# Altium schematic sheet ADC-Schematic.SchDoc: ADC
size A1; Date: *3; DrawnBy: Ali Jafari; Time: ومم
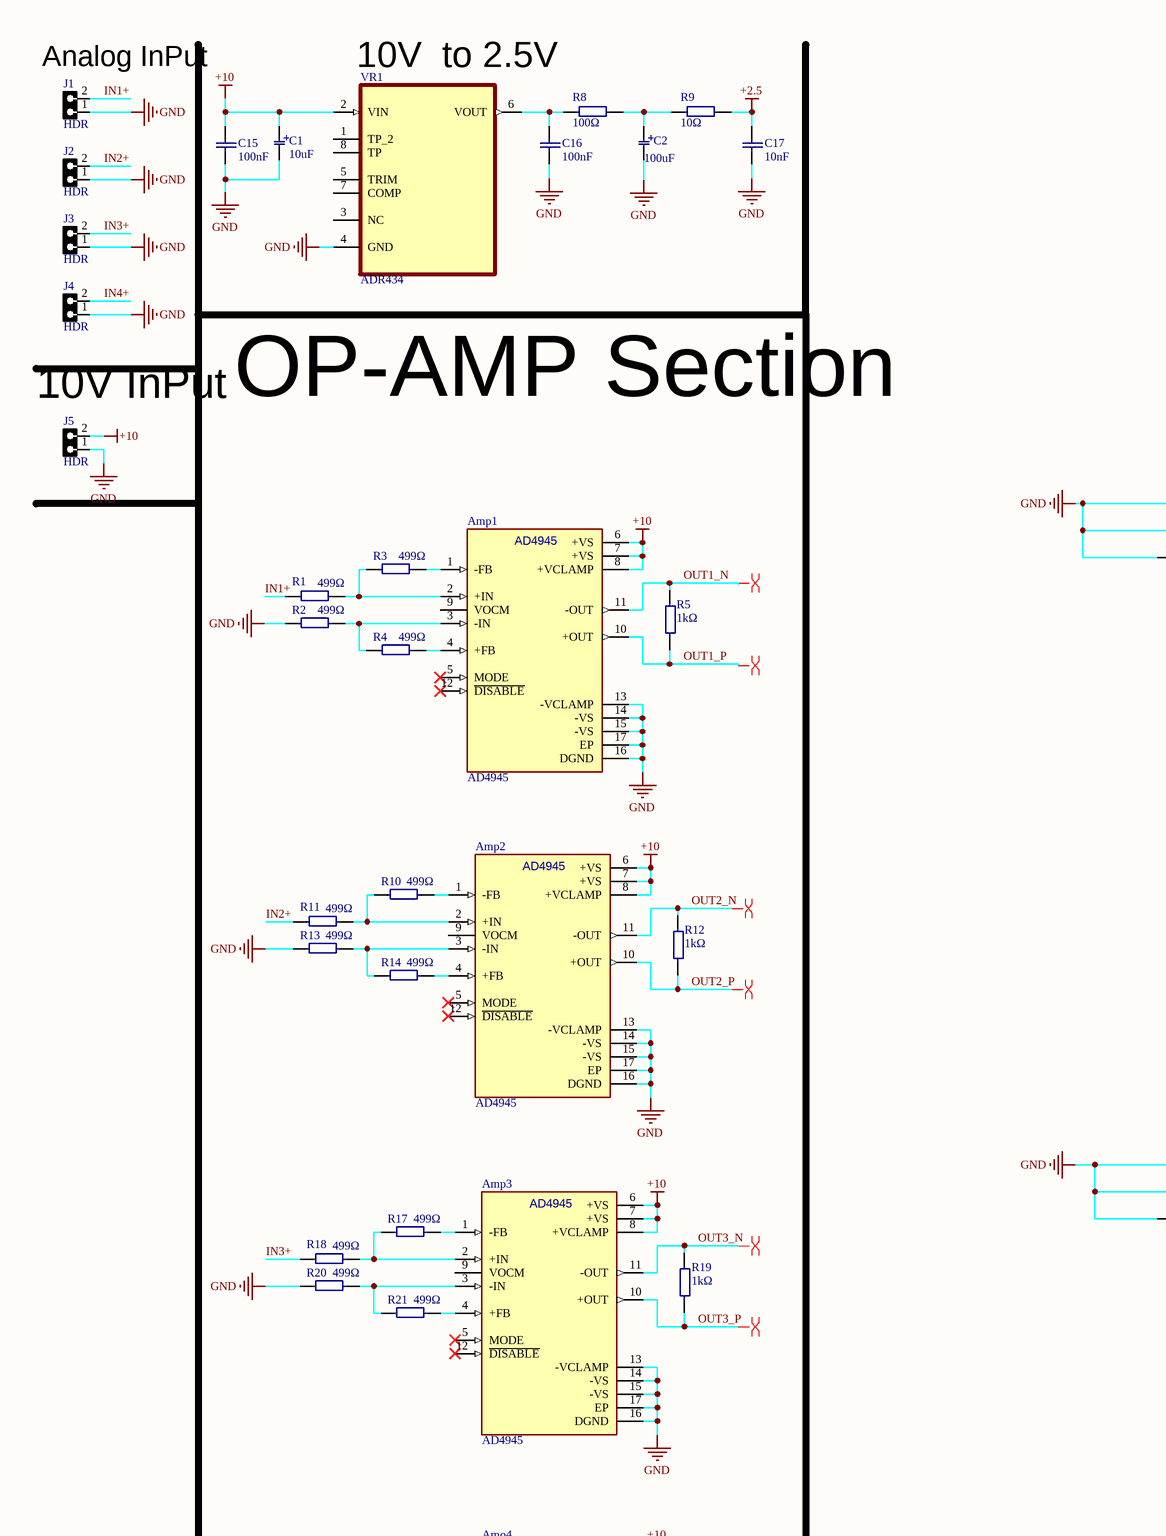
[diagram p0: ADC-Schematic.SchDoc, top left]
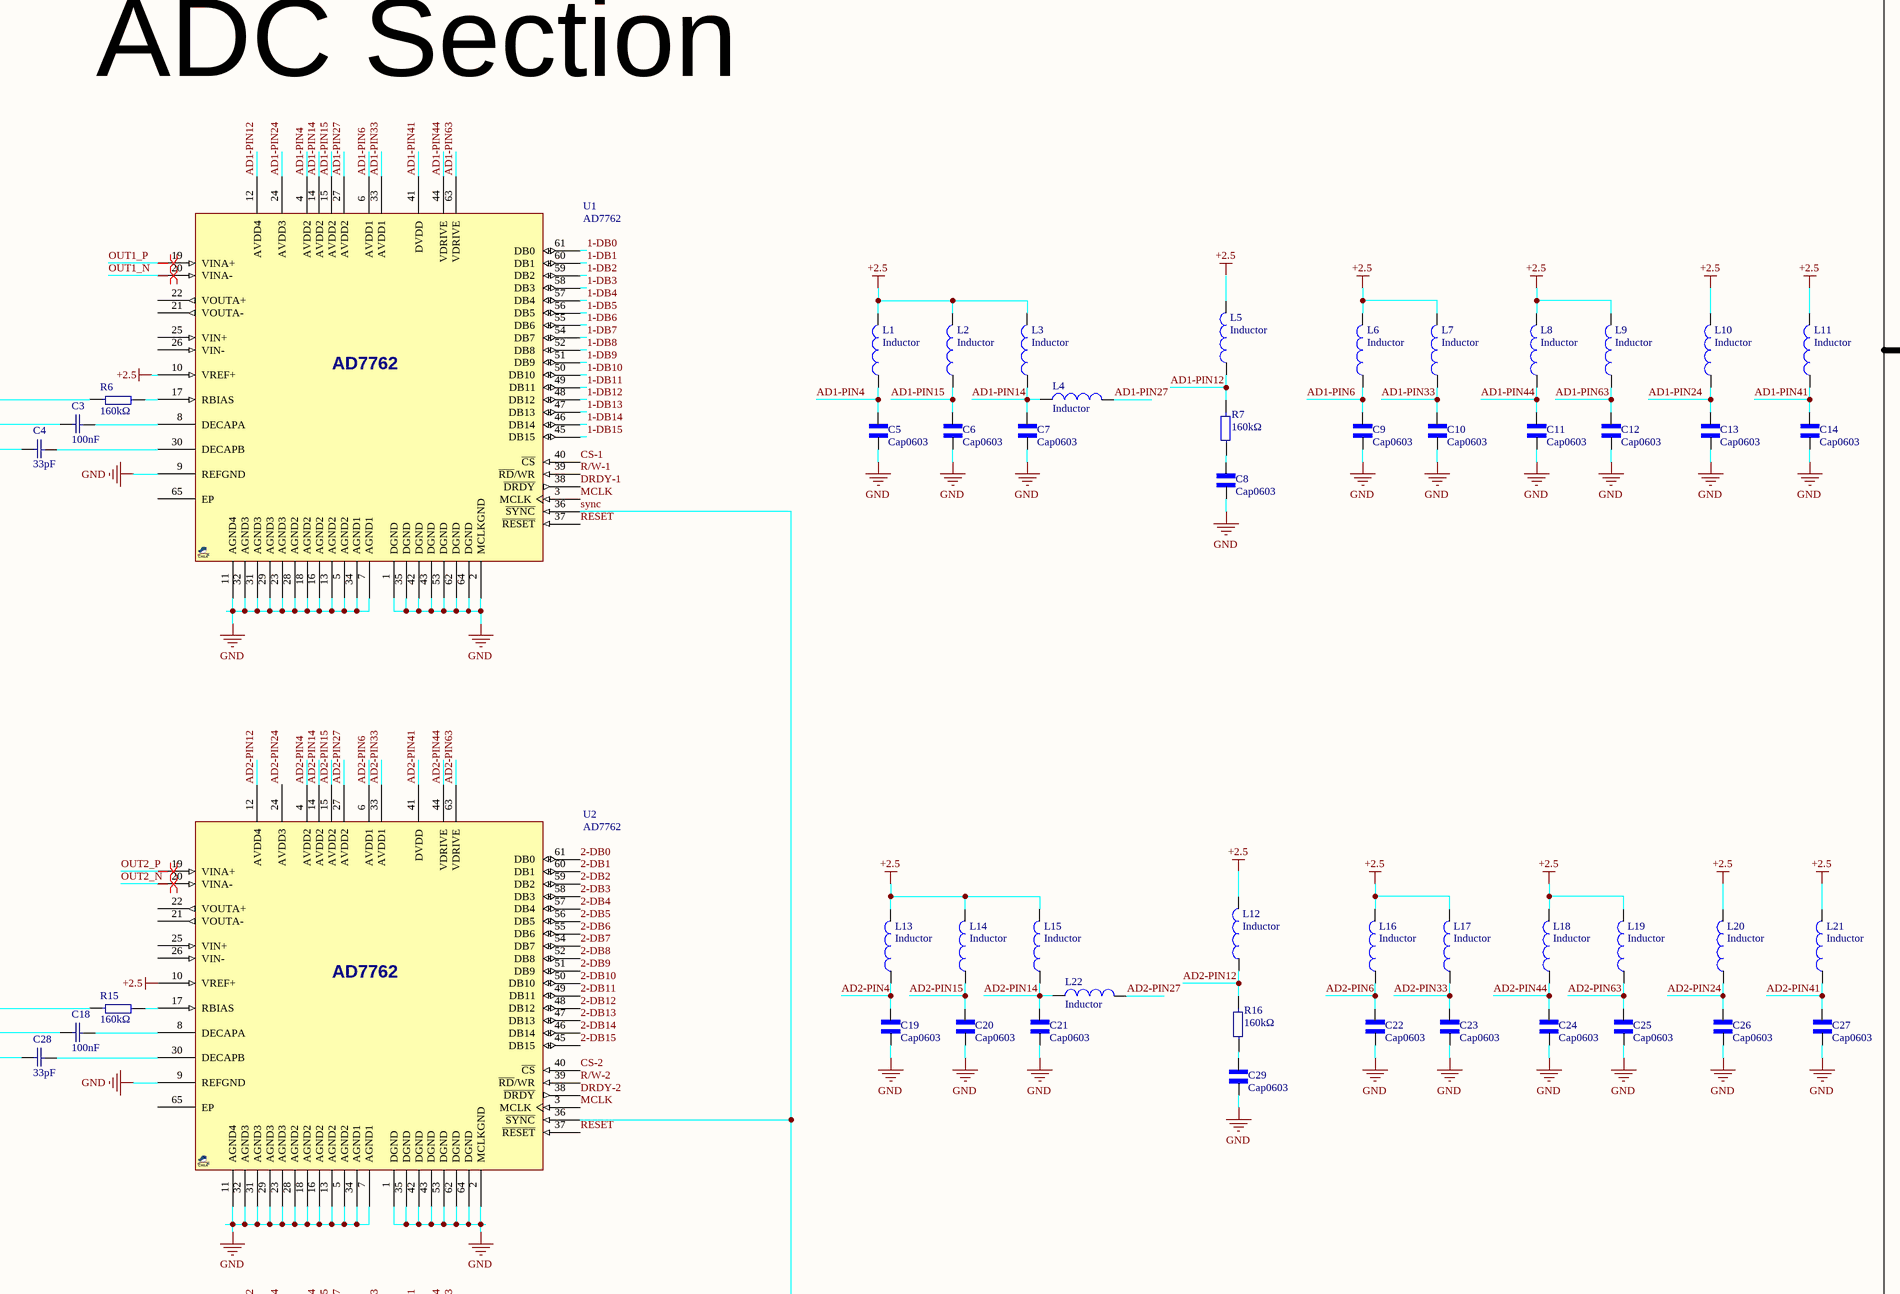
[diagram p1: ADC-Schematic.SchDoc, top middle]
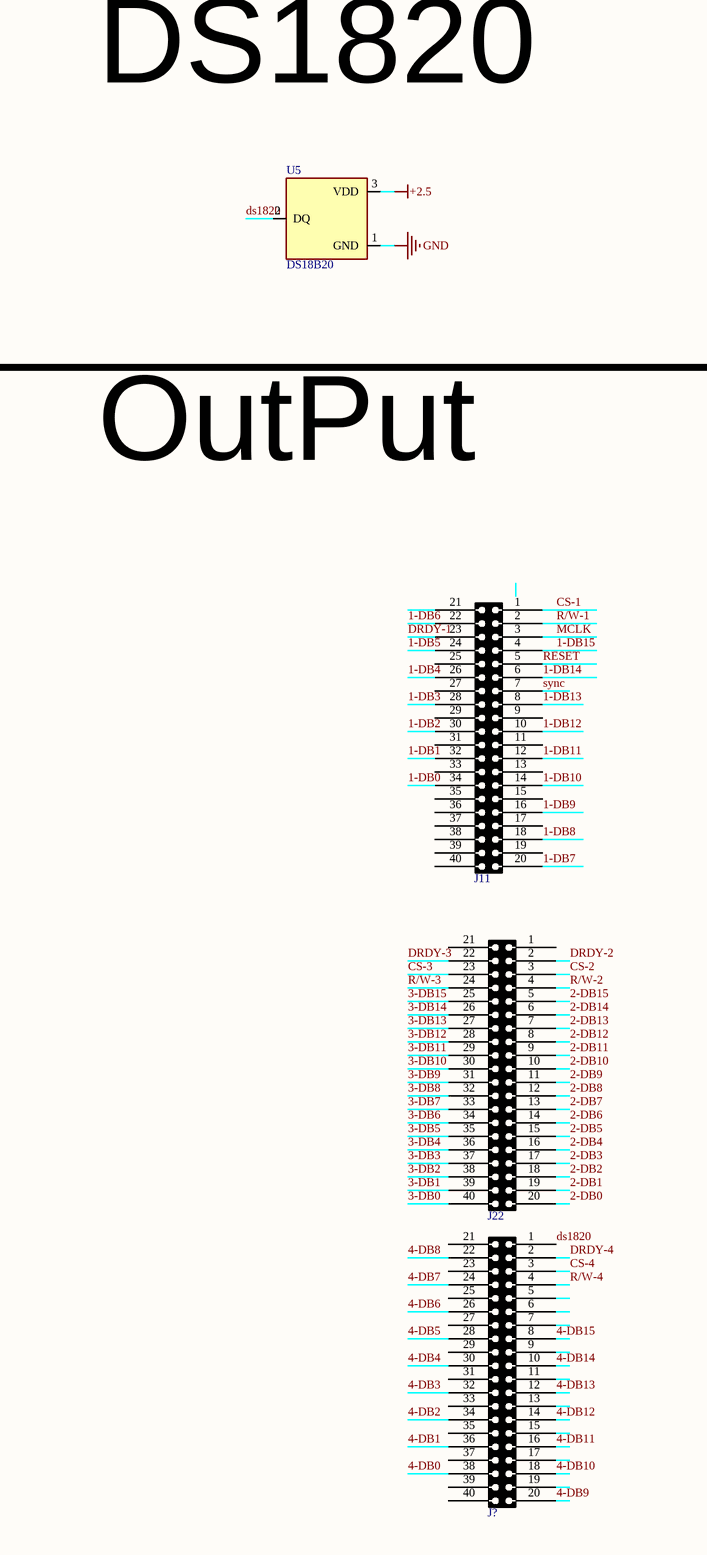
[diagram p2: ADC-Schematic.SchDoc, top right]
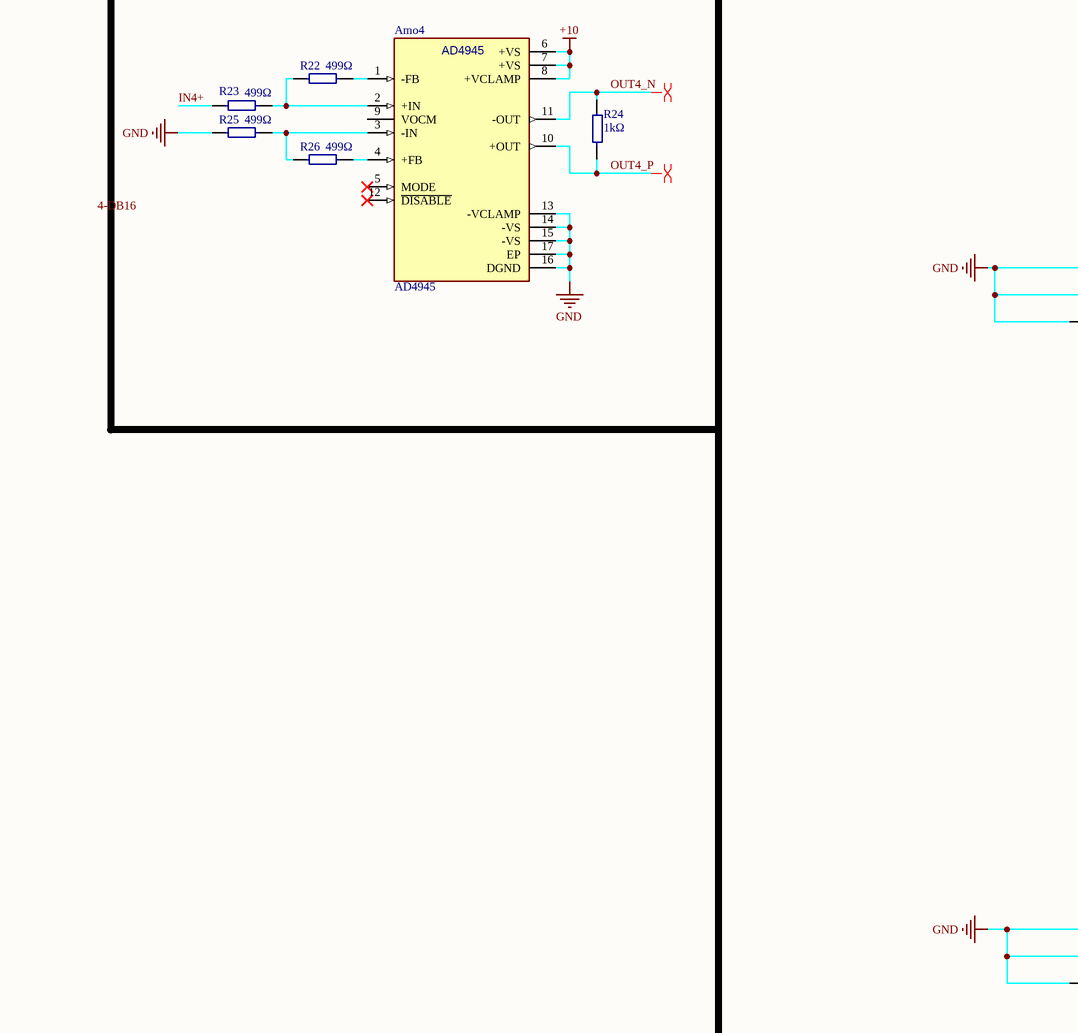
[diagram p3: ADC-Schematic.SchDoc, bottom left]
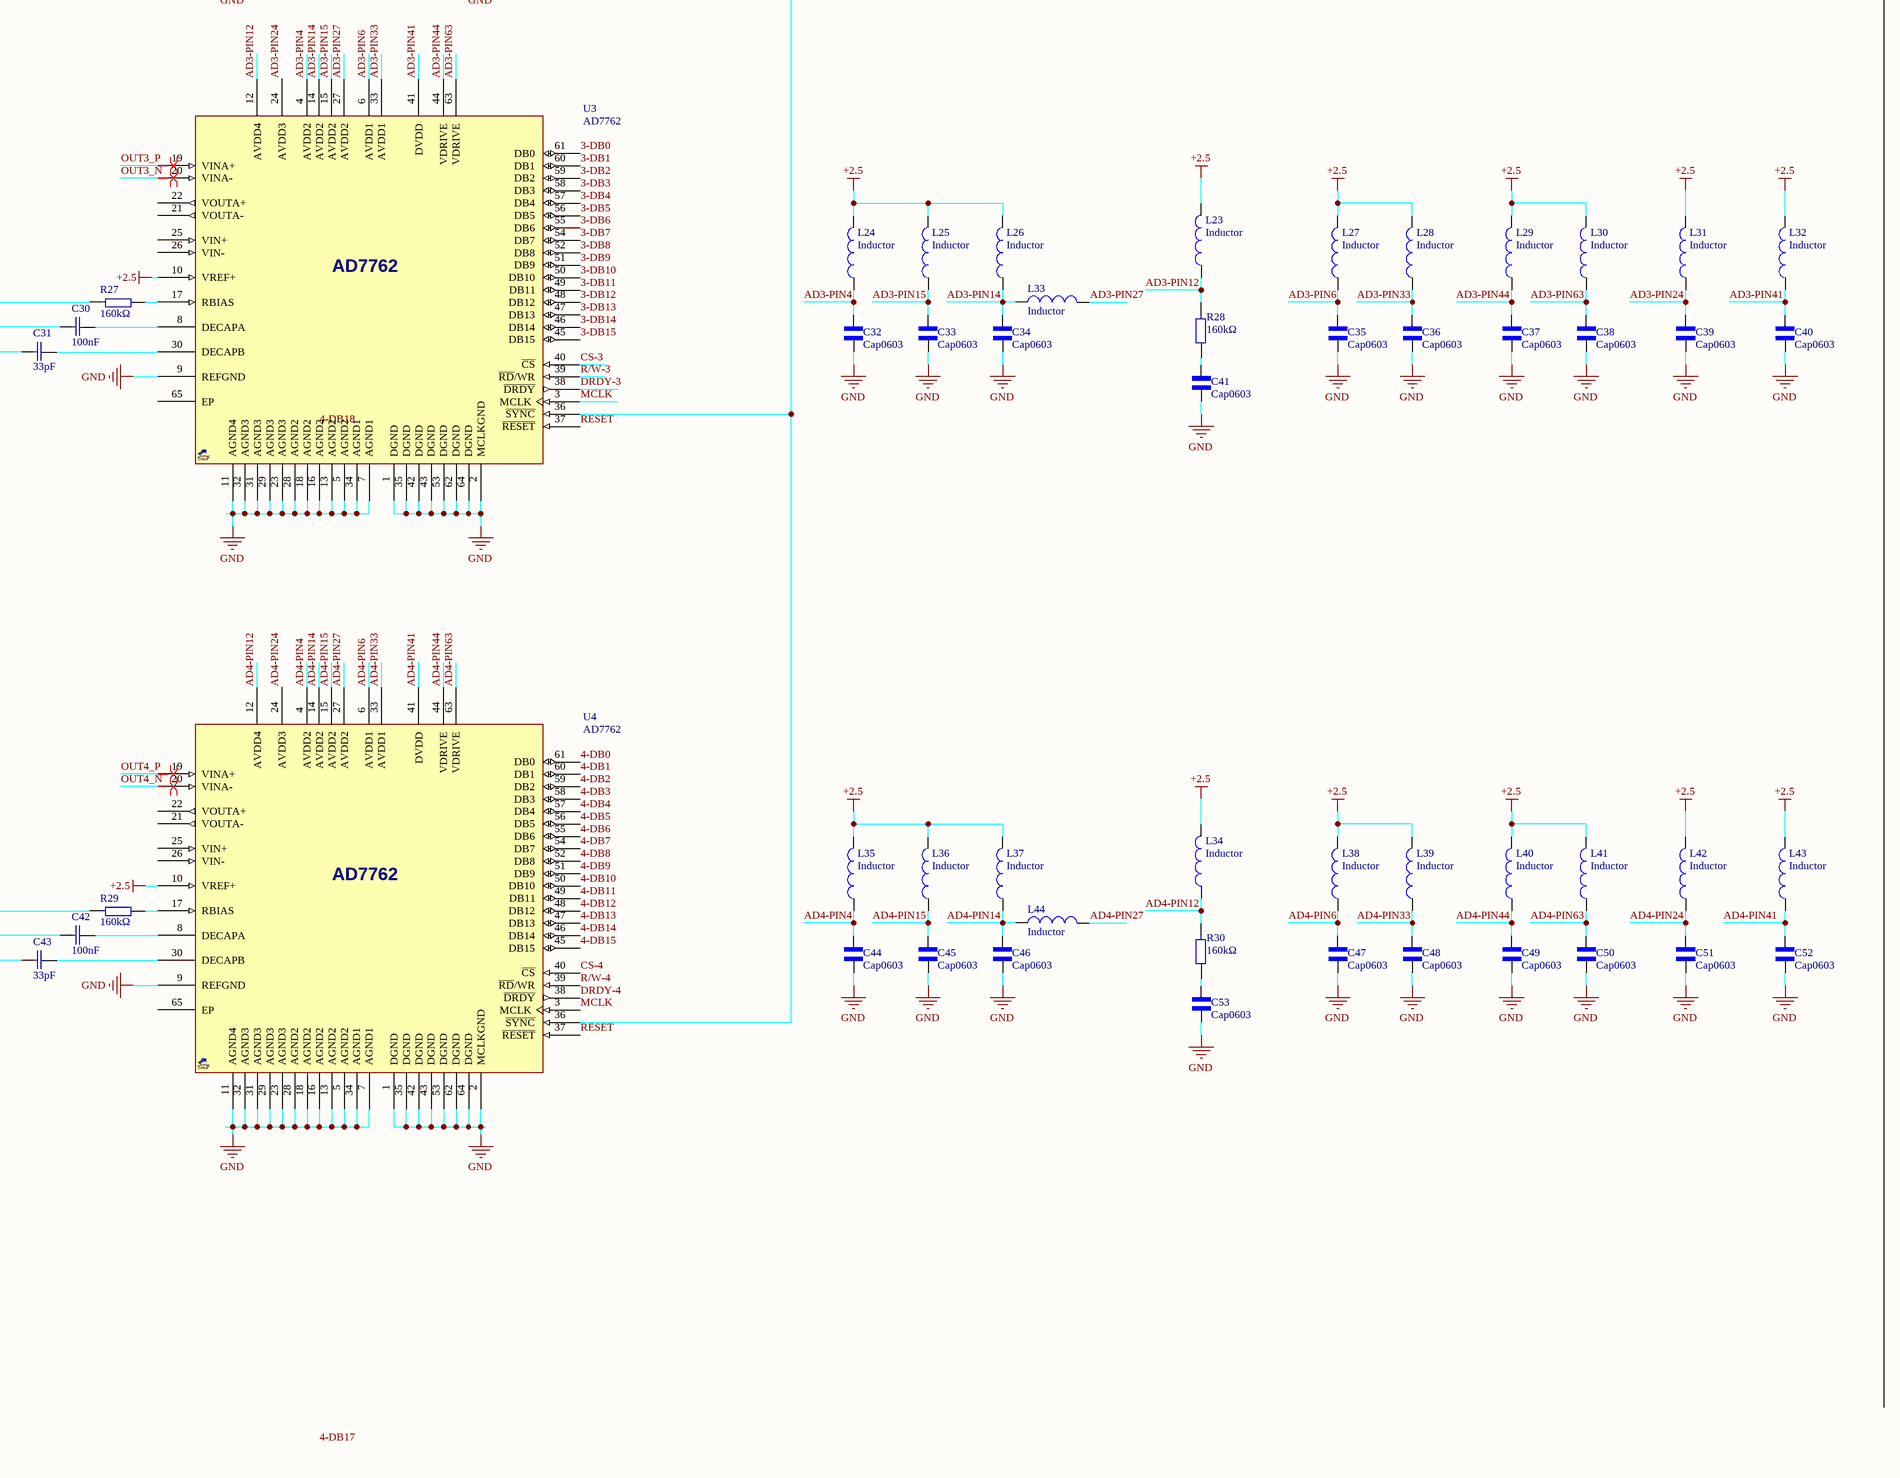
[diagram p4: ADC-Schematic.SchDoc, bottom middle]
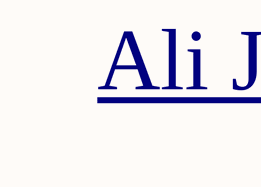
[diagram p5: ADC-Schematic.SchDoc, bottom right]

## Parts
Amo4  AD4945  [AD4945]
Amp1  AD4945  [AD4945]
Amp2  AD4945  [AD4945]
Amp3  AD4945  [AD4945]
C1  10uF  [CAP POL]
C2  100uF  [CAP POL]
C3  100nF  [CAP-smd]
C4  33pF  [CAP-smd]
C5  Cap0603  [CAP0603]
C6  Cap0603  [CAP0603]
C7  Cap0603  [CAP0603]
C8  Cap0603  [CAP0603]
C9  Cap0603  [CAP0603]
C10  Cap0603  [CAP0603]
C11  Cap0603  [CAP0603]
C12  Cap0603  [CAP0603]
C13  Cap0603  [CAP0603]
C14  Cap0603  [CAP0603]
C15  100nF  [CAP-smd]
C16  100nF  [CAP-smd]
C17  10nF  [CAP-smd]
C18  100nF  [CAP-smd]
C19  Cap0603  [CAP0603]
C20  Cap0603  [CAP0603]
C21  Cap0603  [CAP0603]
C22  Cap0603  [CAP0603]
C23  Cap0603  [CAP0603]
C24  Cap0603  [CAP0603]
C25  Cap0603  [CAP0603]
C26  Cap0603  [CAP0603]
C27  Cap0603  [CAP0603]
C28  33pF  [CAP-smd]
C29  Cap0603  [CAP0603]
C30  100nF  [CAP-smd]
C31  33pF  [CAP-smd]
C32  Cap0603  [CAP0603]
C33  Cap0603  [CAP0603]
C34  Cap0603  [CAP0603]
C35  Cap0603  [CAP0603]
C36  Cap0603  [CAP0603]
C37  Cap0603  [CAP0603]
C38  Cap0603  [CAP0603]
C39  Cap0603  [CAP0603]
C40  Cap0603  [CAP0603]
C41  Cap0603  [CAP0603]
C42  100nF  [CAP-smd]
C43  33pF  [CAP-smd]
C44  Cap0603  [CAP0603]
C45  Cap0603  [CAP0603]
C46  Cap0603  [CAP0603]
C47  Cap0603  [CAP0603]
C48  Cap0603  [CAP0603]
C49  Cap0603  [CAP0603]
C50  Cap0603  [CAP0603]
C51  Cap0603  [CAP0603]
C52  Cap0603  [CAP0603]
C53  Cap0603  [CAP0603]
J1  HDR  [HDRLP_M_1X2]
J2  HDR  [HDRLP_M_1X2]
J3  HDR  [HDRLP_M_1X2]
J4  HDR  [HDRLP_M_1X2]
J5  HDR  [HDRLP_M_1X2]
J11  HDRF_2X20  [zunq]  (value not drawn)
J22  HDRF_2X20  [zunq]  (value not drawn)
J?  HDRF_2X20  [zunq]  (value not drawn)
L1  Inductor  [INDC]
L2  Inductor  [INDC]
L3  Inductor  [INDC]
L4  Inductor  [INDC]
L5  Inductor  [INDC]
L6  Inductor  [INDC]
L7  Inductor  [INDC]
L8  Inductor  [INDC]
L9  Inductor  [INDC]
L10  Inductor  [INDC]
L11  Inductor  [INDC]
L12  Inductor  [INDC]
L13  Inductor  [INDC]
L14  Inductor  [INDC]
L15  Inductor  [INDC]
L16  Inductor  [INDC]
L17  Inductor  [INDC]
L18  Inductor  [INDC]
L19  Inductor  [INDC]
L20  Inductor  [INDC]
L21  Inductor  [INDC]
L22  Inductor  [INDC]
L23  Inductor  [INDC]
L24  Inductor  [INDC]
L25  Inductor  [INDC]
L26  Inductor  [INDC]
L27  Inductor  [INDC]
L28  Inductor  [INDC]
L29  Inductor  [INDC]
L30  Inductor  [INDC]
L31  Inductor  [INDC]
L32  Inductor  [INDC]
L33  Inductor  [INDC]
L34  Inductor  [INDC]
L35  Inductor  [INDC]
L36  Inductor  [INDC]
L37  Inductor  [INDC]
L38  Inductor  [INDC]
L39  Inductor  [INDC]
L40  Inductor  [INDC]
L41  Inductor  [INDC]
L42  Inductor  [INDC]
L43  Inductor  [INDC]
L44  Inductor  [INDC]
R1  499Ω  [RES-SMD-1206]
R2  499Ω  [RES-SMD-1206]
R3  499Ω  [RES-SMD-1206]
R4  499Ω  [RES-SMD-1206]
R5  1kΩ  [RES-SMD-1206]
R6  160kΩ  [RES-SMD-1206]
R7  160kΩ  [RES-SMD-1206]
R8  100Ω  [RES]
R9  10Ω  [RES]
R10  499Ω  [RES-SMD-1206]
R11  499Ω  [RES-SMD-1206]
R12  1kΩ  [RES-SMD-1206]
R13  499Ω  [RES-SMD-1206]
R14  499Ω  [RES-SMD-1206]
R15  160kΩ  [RES-SMD-1206]
R16  160kΩ  [RES-SMD-1206]
R17  499Ω  [RES-SMD-1206]
R18  499Ω  [RES-SMD-1206]
R19  1kΩ  [RES-SMD-1206]
R20  499Ω  [RES-SMD-1206]
R21  499Ω  [RES-SMD-1206]
R22  499Ω  [RES-SMD-1206]
R23  499Ω  [RES-SMD-1206]
R24  1kΩ  [RES-SMD-1206]
R25  499Ω  [RES-SMD-1206]
R26  499Ω  [RES-SMD-1206]
R27  160kΩ  [RES-SMD-1206]
R28  160kΩ  [RES-SMD-1206]
R29  160kΩ  [RES-SMD-1206]
R30  160kΩ  [RES-SMD-1206]
U1  AD7762  [AD7762]
U2  AD7762  [AD7762]
U3  AD7762  [AD7762]
U4  AD7762  [AD7762]
U5  DS18B20  [DS1820]
VR1  ADR434  [ADR434]

## Nets
+2.5: C17.1 L1.2 L2.2 L3.2 L5.2 L6.2 L7.2 L8.2 L9.2 L10.2 L11.2 L12.2 L13.2 L14.2 L15.2 L16.2 L17.2 L18.2 L19.2 L20.2 L21.2 L23.2 L24.2 L25.2 L26.2 L27.2 L28.2 L29.2 L30.2 L31.2 L32.2 L34.2 L35.2 L36.2 L37.2 L38.2 L39.2 L40.2 L41.2 L42.2 L43.2 R9.2 U1.10(VREF+) U2.10(VREF+) U3.10(VREF+) U4.10(VREF+) U5.3(VDD)
+10: Amo4.6(+VS) Amo4.7(+VS) Amo4.8(+VCLAMP) Amp1.6(+VS) Amp1.7(+VS) Amp1.8(+VCLAMP) Amp2.6(+VS) Amp2.7(+VS) Amp2.8(+VCLAMP) Amp3.6(+VS) Amp3.7(+VS) Amp3.8(+VCLAMP) C1.a C15.1 J5.2 VR1.2(VIN)
GND: Amo4.13(-VCLAMP) Amo4.14(-VS) Amo4.15(-VS) Amo4.16(DGND) Amo4.17(EP) Amp1.13(-VCLAMP) Amp1.14(-VS) Amp1.15(-VS) Amp1.16(DGND) Amp1.17(EP) Amp2.13(-VCLAMP) Amp2.14(-VS) Amp2.15(-VS) Amp2.16(DGND) Amp2.17(EP) Amp3.13(-VCLAMP) Amp3.14(-VS) Amp3.15(-VS) Amp3.16(DGND) Amp3.17(EP) C1.b C2.b C3.1 C4.1 C5.2 C6.2 C7.2 C8.2 C9.2 C10.2 C11.2 C12.2 C13.2 C14.2 C15.2 C16.2 C17.2 C18.1 C19.2 C20.2 C21.2 C22.2 C23.2 C24.2 C25.2 C26.2 C27.2 C28.1 C29.2 C30.1 C31.1 C32.2 C33.2 C34.2 C35.2 C36.2 C37.2 C38.2 C39.2 C40.2 C41.2 C42.1 C43.1 C44.2 C45.2 C46.2 C47.2 C48.2 C49.2 C50.2 C51.2 C52.2 C53.2 J1.1 J2.1 J3.1 J4.1 J5.1 R2.1 R6.2 R13.1 R15.2 R20.1 R25.1 R27.2 R29.2 U1.1(DGND) U1.2(MCLKGND) U1.5(AGND2) U1.7(AGND1) U1.9(REFGND) U1.11(AGND4) U1.13(AGND2) U1.16(AGND2) U1.18(AGND2) U1.23(AGND3) U1.28(AGND2) U1.29(AGND3) U1.31(AGND3) U1.32(AGND3) U1.34(AGND1) U1.35(DGND) U1.42(DGND) U1.43(DGND) U1.53(DGND) U1.62(DGND) U1.64(DGND) U2.1(DGND) U2.2(MCLKGND) U2.5(AGND2) U2.7(AGND1) U2.9(REFGND) U2.11(AGND4) U2.13(AGND2) U2.16(AGND2) U2.18(AGND2) U2.23(AGND3) U2.28(AGND2) U2.29(AGND3) U2.31(AGND3) U2.32(AGND3) U2.34(AGND1) U2.35(DGND) U2.42(DGND) U2.43(DGND) U2.53(DGND) U2.62(DGND) U2.64(DGND) U3.1(DGND) U3.2(MCLKGND) U3.5(AGND2) U3.7(AGND1) U3.9(REFGND) U3.11(AGND4) U3.13(AGND2) U3.16(AGND2) U3.18(AGND2) U3.23(AGND3) U3.28(AGND2) U3.29(AGND3) U3.31(AGND3) U3.32(AGND3) U3.34(AGND1) U3.35(DGND) U3.42(DGND) U3.43(DGND) U3.53(DGND) U3.62(DGND) U3.64(DGND) U4.1(DGND) U4.2(MCLKGND) U4.5(AGND2) U4.7(AGND1) U4.9(REFGND) U4.11(AGND4) U4.13(AGND2) U4.16(AGND2) U4.18(AGND2) U4.23(AGND3) U4.28(AGND2) U4.29(AGND3) U4.31(AGND3) U4.32(AGND3) U4.34(AGND1) U4.35(DGND) U4.42(DGND) U4.43(DGND) U4.53(DGND) U4.62(DGND) U4.64(DGND) U5.1(GND) VR1.4(GND)
1-DB0: J11.34(VDD_37) U1.61(DB0)
1-DB1: J11.32(VDD_35) U1.60(DB1)
1-DB2: J11.30(VDD_33) U1.59(DB2)
1-DB3: J11.28(VDD_31) U1.58(DB3)
1-DB4: J11.26(VDD_29) U1.57(DB4)
1-DB5: J11.24(VDD_27) U1.56(DB5)
1-DB6: J11.22(VDD_25) U1.55(DB6)
1-DB7: J11.20(VDD_23) U1.54(DB7)
1-DB8: J11.18(VDD_21) U1.52(DB8)
1-DB9: J11.16(VDD_19) U1.51(DB9)
1-DB10: J11.14(VDD_17) U1.50(DB10)
1-DB11: J11.12(VDD_15) U1.49(DB11)
1-DB12: J11.10(VDD_13) U1.48(DB12)
1-DB13: J11.8(VDD_11) U1.47(DB13)
1-DB14: J11.6(VDD_9) U1.46(DB14)
1-DB15: J11.4(VDD_7) U1.45(DB15)
2-DB0: J22.20(VDD_23) U2.61(DB0)
2-DB1: J22.19(VDD_22) U2.60(DB1)
2-DB2: J22.18(VDD_21) U2.59(DB2)
2-DB3: J22.17(VDD_20) U2.58(DB3)
2-DB4: J22.16(VDD_19) U2.57(DB4)
2-DB5: J22.15(VDD_18) U2.56(DB5)
2-DB6: J22.14(VDD_17) U2.55(DB6)
2-DB7: J22.13(VDD_16) U2.54(DB7)
2-DB8: J22.12(VDD_15) U2.52(DB8)
2-DB9: J22.11(VDD_14) U2.51(DB9)
2-DB10: J22.10(VDD_13) U2.50(DB10)
2-DB11: J22.9(VDD_12) U2.49(DB11)
2-DB12: J22.8(VDD_11) U2.48(DB12)
2-DB13: J22.7(VDD_10) U2.47(DB13)
2-DB14: J22.6(VDD_9) U2.46(DB14)
2-DB15: J22.5(VDD_8) U2.45(DB15)
3-DB0: J22.40(VDD_43) U3.61(DB0)
3-DB1: J22.39(VDD_42) U3.60(DB1)
3-DB2: J22.38(VDD_41) U3.59(DB2)
3-DB3: J22.37(VDD_40) U3.58(DB3)
3-DB4: J22.36(VDD_39) U3.57(DB4)
3-DB5: J22.35(VDD_38) U3.56(DB5)
3-DB6: J22.34(VDD_37) U3.55(DB6)
3-DB7: J22.33(VDD_36) U3.54(DB7)
3-DB8: J22.32(VDD_35) U3.52(DB8)
3-DB9: J22.31(VDD_34) U3.51(DB9)
3-DB10: J22.30(VDD_33) U3.50(DB10)
3-DB11: J22.29(VDD_32) U3.49(DB11)
3-DB12: J22.28(VDD_31) U3.48(DB12)
3-DB13: J22.27(VDD_30) U3.47(DB13)
3-DB14: J22.26(VDD_29) U3.46(DB14)
3-DB15: J22.25(VDD_28) U3.45(DB15)
4-DB0: J?.38(VDD_41) U4.61(DB0)
4-DB1: J?.36(VDD_39) U4.60(DB1)
4-DB2: J?.34(VDD_37) U4.59(DB2)
4-DB3: J?.32(VDD_35) U4.58(DB3)
4-DB4: J?.30(VDD_33) U4.57(DB4)
4-DB5: J?.28(VDD_31) U4.56(DB5)
4-DB6: J?.26(VDD_29) U4.55(DB6)
4-DB7: J?.24(VDD_27) U4.54(DB7)
4-DB8: J?.22(VDD_25) U4.52(DB8)
4-DB9: J?.20(VDD_23) U4.51(DB9)
4-DB10: J?.18(VDD_21) U4.50(DB10)
4-DB11: J?.16(VDD_19) U4.49(DB11)
4-DB12: J?.14(VDD_17) U4.48(DB12)
4-DB13: J?.12(VDD_15) U4.47(DB13)
4-DB14: J?.10(VDD_13) U4.46(DB14)
4-DB15: J?.8(VDD_11) U4.45(DB15)
AD1-PIN4: C5.1 L1.1 U1.4(AVDD2)
AD1-PIN6: C9.1 L6.1 U1.6(AVDD1)
AD1-PIN12: L5.1 R7.2 U1.12(AVDD4)
AD1-PIN14: C7.1 L3.1 L4.1 U1.14(AVDD2)
AD1-PIN15: C6.1 L2.1 U1.15(AVDD2)
AD1-PIN24: C13.1 L10.1 U1.24(AVDD3)
AD1-PIN27: L4.2 U1.27(AVDD2)
AD1-PIN33: C10.1 L7.1 U1.33(AVDD1)
AD1-PIN41: C14.1 L11.1 U1.41(DVDD)
AD1-PIN44: C11.1 L8.1 U1.44(VDRIVE)
AD1-PIN63: C12.1 L9.1 U1.63(VDRIVE)
AD2-PIN4: C19.1 L13.1 U2.4(AVDD2)
AD2-PIN6: C22.1 L16.1 U2.6(AVDD1)
AD2-PIN12: L12.1 R16.2 U2.12(AVDD4)
AD2-PIN14: C21.1 L15.1 L22.1 U2.14(AVDD2)
AD2-PIN15: C20.1 L14.1 U2.15(AVDD2)
AD2-PIN24: C26.1 L20.1 U2.24(AVDD3)
AD2-PIN27: L22.2 U2.27(AVDD2)
AD2-PIN33: C23.1 L17.1 U2.33(AVDD1)
AD2-PIN41: C27.1 L21.1 U2.41(DVDD)
AD2-PIN44: C24.1 L18.1 U2.44(VDRIVE)
AD2-PIN63: C25.1 L19.1 U2.63(VDRIVE)
AD3-PIN4: C32.1 L24.1 U3.4(AVDD2)
AD3-PIN6: C35.1 L27.1 U3.6(AVDD1)
AD3-PIN12: L23.1 R28.2 U3.12(AVDD4)
AD3-PIN14: C34.1 L26.1 L33.1 U3.14(AVDD2)
AD3-PIN15: C33.1 L25.1 U3.15(AVDD2)
AD3-PIN24: C39.1 L31.1 U3.24(AVDD3)
AD3-PIN27: L33.2 U3.27(AVDD2)
AD3-PIN33: C36.1 L28.1 U3.33(AVDD1)
AD3-PIN41: C40.1 L32.1 U3.41(DVDD)
AD3-PIN44: C37.1 L29.1 U3.44(VDRIVE)
AD3-PIN63: C38.1 L30.1 U3.63(VDRIVE)
AD4-PIN4: C44.1 L35.1 U4.4(AVDD2)
AD4-PIN6: C47.1 L38.1 U4.6(AVDD1)
AD4-PIN12: L34.1 R30.2 U4.12(AVDD4)
AD4-PIN14: C46.1 L37.1 L44.1 U4.14(AVDD2)
AD4-PIN15: C45.1 L36.1 U4.15(AVDD2)
AD4-PIN24: C51.1 L42.1 U4.24(AVDD3)
AD4-PIN27: L44.2 U4.27(AVDD2)
AD4-PIN33: C48.1 L39.1 U4.33(AVDD1)
AD4-PIN41: C52.1 L43.1 U4.41(DVDD)
AD4-PIN44: C49.1 L40.1 U4.44(VDRIVE)
AD4-PIN63: C50.1 L41.1 U4.63(VDRIVE)
CS-1: J11.1(VDD_4) U1.40(~{CS})
CS-2: J22.3(VDD_6) U2.40(~{CS})
CS-3: J22.23(VDD_26) U3.40(~{CS})
CS-4: J?.3(VDD_6) U4.40(~{CS})
DRDY-1: J11.23(VDD_26) U1.38(~{DRDY})
DRDY-2: J22.2(VDD_5) U2.38(~{DRDY})
DRDY-3: J22.22(VDD_25) U3.38(~{DRDY})
DRDY-4: J?.2(VDD_5) U4.38(~{DRDY})
ds1820: J?.1(VDD_4) U5.2(DQ)
IN1+: J1.2 R1.1
IN2+: J2.2 R11.1
IN3+: J3.2 R18.1
IN4+: J4.2 R23.1
MCLK: J11.3(VDD_6) U1.3(MCLK) U2.3(MCLK) U3.3(MCLK) U4.3(MCLK)
OUT1_N: Amp1.11(-OUT) R5.1 U1.20(VINA-)
OUT1_P: Amp1.10(+OUT) R5.2 U1.19(VINA+)
OUT2_N: Amp2.11(-OUT) R12.1 U2.20(VINA-)
OUT2_P: Amp2.10(+OUT) R12.2 U2.19(VINA+)
OUT3_N: Amp3.11(-OUT) R19.1 U3.20(VINA-)
OUT3_P: Amp3.10(+OUT) R19.2 U3.19(VINA+)
OUT4_N: Amo4.11(-OUT) R24.1 U4.20(VINA-)
OUT4_P: Amo4.10(+OUT) R24.2 U4.19(VINA+)
R/W-1: J11.2(VDD_5) U1.39(~{RD}/WR)
R/W-2: J22.4(VDD_7) U2.39(~{RD}/WR)
R/W-3: J22.24(VDD_27) U3.39(~{RD}/WR)
R/W-4: J?.4(VDD_7) U4.39(~{RD}/WR)
RESET: J11.5(VDD_8) U1.37(~{RESET}) U2.37(~{RESET}) U3.37(~{RESET}) U4.37(~{RESET})
sync: J11.7(VDD_10) U1.36(~{SYNC}) U2.36(~{SYNC}) U3.36(~{SYNC}) U4.36(~{SYNC})
NetAmo4_1: Amo4.1(-FB) R22.2
NetAmo4_2: Amo4.2(+IN) R22.1 R23.2
NetAmo4_3: Amo4.3(-IN) R25.2 R26.1
NetAmo4_4: Amo4.4(+FB) R26.2
NetAmp1_1: Amp1.1(-FB) R3.2
NetAmp1_2: Amp1.2(+IN) R1.2 R3.1
NetAmp1_3: Amp1.3(-IN) R2.2 R4.1
NetAmp1_4: Amp1.4(+FB) R4.2
NetAmp2_1: Amp2.1(-FB) R10.2
NetAmp2_2: Amp2.2(+IN) R10.1 R11.2
NetAmp2_3: Amp2.3(-IN) R13.2 R14.1
NetAmp2_4: Amp2.4(+FB) R14.2
NetAmp3_1: Amp3.1(-FB) R17.2
NetAmp3_2: Amp3.2(+IN) R17.1 R18.2
NetAmp3_3: Amp3.3(-IN) R20.2 R21.1
NetAmp3_4: Amp3.4(+FB) R21.2
NetC2_a: C2.a R8.2 R9.1
NetC3_2: C3.2 U1.8(DECAPA)
NetC4_2: C4.2 U1.30(DECAPB)
NetC8_1: C8.1 R7.1
NetC16_1: C16.1 R8.1 VR1.6(VOUT)
NetC18_2: C18.2 U2.8(DECAPA)
NetC28_2: C28.2 U2.30(DECAPB)
NetC29_1: C29.1 R16.1
NetC30_2: C30.2 U3.8(DECAPA)
NetC31_2: C31.2 U3.30(DECAPB)
NetC41_1: C41.1 R28.1
NetC42_2: C42.2 U4.8(DECAPA)
NetC43_2: C43.2 U4.30(DECAPB)
NetC53_1: C53.1 R30.1
NetR6_1: R6.1 U1.17(RBIAS)
NetR15_1: R15.1 U2.17(RBIAS)
NetR27_1: R27.1 U3.17(RBIAS)
NetR29_1: R29.1 U4.17(RBIAS)

Not connected (* = marked no-connect by the designer): Amo4 5(MODE)* 9(VOCM) 12(~{DISABLE})*; Amp1 5(MODE)* 9(VOCM) 12(~{DISABLE})*; Amp2 5(MODE)* 9(VOCM) 12(~{DISABLE})*; Amp3 5(MODE)* 9(VOCM) 12(~{DISABLE})*; J11 9(VDD_12) 11(VDD_14) 13(VDD_16) 15(VDD_18) 17(VDD_20) 19(VDD_22) 21(VDD_24) 25(VDD_28) 27(VDD_30) 29(VDD_32) 31(VDD_34) 33(VDD_36) 35(VDD_38) 36(VDD_39) 37(VDD_40) 38(VDD_41) 39(VDD_42) 40(VDD_43); J22 1(VDD_4) 21(VDD_24); J? 5(VDD_8) 6(VDD_9) 7(VDD_10) 9(VDD_12) 11(VDD_14) 13(VDD_16) 15(VDD_18) 17(VDD_20) 19(VDD_22) 21(VDD_24) 23(VDD_26) 25(VDD_28) 27(VDD_30) 29(VDD_32) 31(VDD_34) 33(VDD_36) 35(VDD_38) 37(VDD_40) 39(VDD_42) 40(VDD_43); U1 21(VOUTA-) 22(VOUTA+) 25(VIN+) 26(VIN-) 65(EP); U2 21(VOUTA-) 22(VOUTA+) 25(VIN+) 26(VIN-) 65(EP); U3 21(VOUTA-) 22(VOUTA+) 25(VIN+) 26(VIN-) 65(EP); U4 21(VOUTA-) 22(VOUTA+) 25(VIN+) 26(VIN-) 65(EP); VR1 1(TP_2) 3(NC) 5(TRIM) 7(COMP) 8(TP)

## Layout directives
differential pair: OUT1_N, OUT1_P, OUT2_N, OUT2_P, OUT3_N, OUT3_P, OUT4_N, OUT4_P

## Notes on the sheet
- (near J1) Analog InPut
- 10V  to 2.5V
- ADC Section
- DS1820
- (near J5) 10V InPut
- OP-AMP Section
- OutPut
- Ali Jafari
- Labels drawn without touching a wire or pin: 4-DB16, 4-DB17, 4-DB18

## Library data of the parts
Amo4 Amp1-Amp3 = AD4945: ADC Driver IC Data Acquisition 16-LFCSP (3x3); MF: Analog Devices; MP: ADA4945-1ACPZ-R7; Availability: Warning; SnapEDA_Link: https://www.snapeda.com/parts/ADA4945-1ACPZ-R7/Analog%20Devices/view-part/4333092/?ref=snap; Mouser-Purchase-URL: https://snapeda.com/shop?store=Mouser&id=4333092; Value: *; Price: None; Package: LFCSP -16 Analog Devices
C1 C2 = CAP Pol
C3 C4 C15-C18 C28 C30 C31 C42 C43 = CAP-smd
C5-C14 C19-C27 C29 C32-C41 C44-C53 = Cap0603: 0.1 ÂµF Â±10% 50V Ceramic Capacitor X7R 0603 (1608 Metric); MF: Yageo; MP: CC0603KRX7R9BB104; SnapEDA_Link: https://www.snapeda.com/parts/CC0603KRX7R9BB104/Yageo/view-part/?ref=snap; Package: 0603 Yageo; Value: *; Check_prices: https://www.snapeda.com/parts/CC0603KRX7R9BB104/Yageo/view-part/?ref=eda
J1-J5 = HDRR_F_1X2: CONN, HEADER, Female, pitch: 2.54mm, 2POS; VALUE: HDRF2
J11 J22 J? = HDRR_F_2X20: CONN, HEADER, Female, pitch: 2.54mm, 40POS; VALUE: HDRF_2X20
L1-L44 = Inductor: Inductor with Inductance: 15nH Tol. +/-3%, Package: 0402 (1005); MP: LQW15AN15NH00D; MF: Murata; Price: None; SnapEDA_Link: https://www.snapeda.com/parts/LQW15AN15NH00D/Murata%20Electronics%20North%20America/view-part/1499752/?ref=snap; Availability: Good; Mouser-Purchase-URL: https://snapeda.com/shop?store=Mouser&id=1499752; Value: *; DigiKey-Purchase-URL: https://snapeda.com/shop?store=DigiKey&id=1499752; Package: 1006 Murata
R1-R7 R10-R30 = RES-SMD
R8 R9 = RES
U1-U4 = AD7762: ADC, 24-Bit, 2.5MSPS, Sigma-Delta, Parallel Interface, SV-64-2; MANF: Analog Devices; MANF_P#: AD7760BSVZ; DIST#: Mouser/584-AD7760BSVZ; VALUE: AD7762
U5 = DS18B20: Temperature Sensor Digital, Local -55Â°C ~ 125Â°C 12 b 8-uMAX-EP¦8-uSOP-EP; MF: Maxim; Value: *; SnapEDA_Link: https://www.snapeda.com/parts/DS18B20/Maxim+Integrated/view-part/?ref=snap; Purchase-URL: https://pricing.snapeda.com/search/part/DS18B20/?ref=eda; Availability: In Stock; Price: None; Package: TO-226-3 Maxim; Check_prices: https://www.snapeda.com/parts/DS18B20/Maxim+Integrated/view-part/?ref=eda; MP: DS18B20
VR1 = ADR434: ÐžÐ¿Ð¾Ñ€Ð½Ð¾Ðµ Ð½Ð°Ð¿Ñ€ÑÐ¶ÐµÐ½Ð¸Ðµ ÑÐµÑ€Ð¸Ð¸ IC Ð¤Ð¸ÐºÑÐ¸Ñ€Ð¾Ð²Ð°Ð½Ð½Ð¾Ðµ 4,096 Ð’ Â±0,04% 30 Ð¼Ð 8-SOIC; MP: ADR434BRZ; MF: Analog Devices; SnapEDA_Link: https://www.snapeda.com/parts/ADR434BRZ/Analog%20Devices%20Inc./view-part/436542/?ref=snap; Package: SOIC-8 Analog Devices; Purchase-URL: https://pricing.snapeda.com/search/part/ADR434BRZ/?ref=eda; Availability: In Stock; Price: None; Check_prices: https://www.snapeda.com/parts/ADR434BRZ/Analog%20Devices%20Inc./view-part/436542/?ref=eda; Value: *